# EAGLE design ServoBoard (EAGLE 9.7.0)

## Sheet 1 of 4
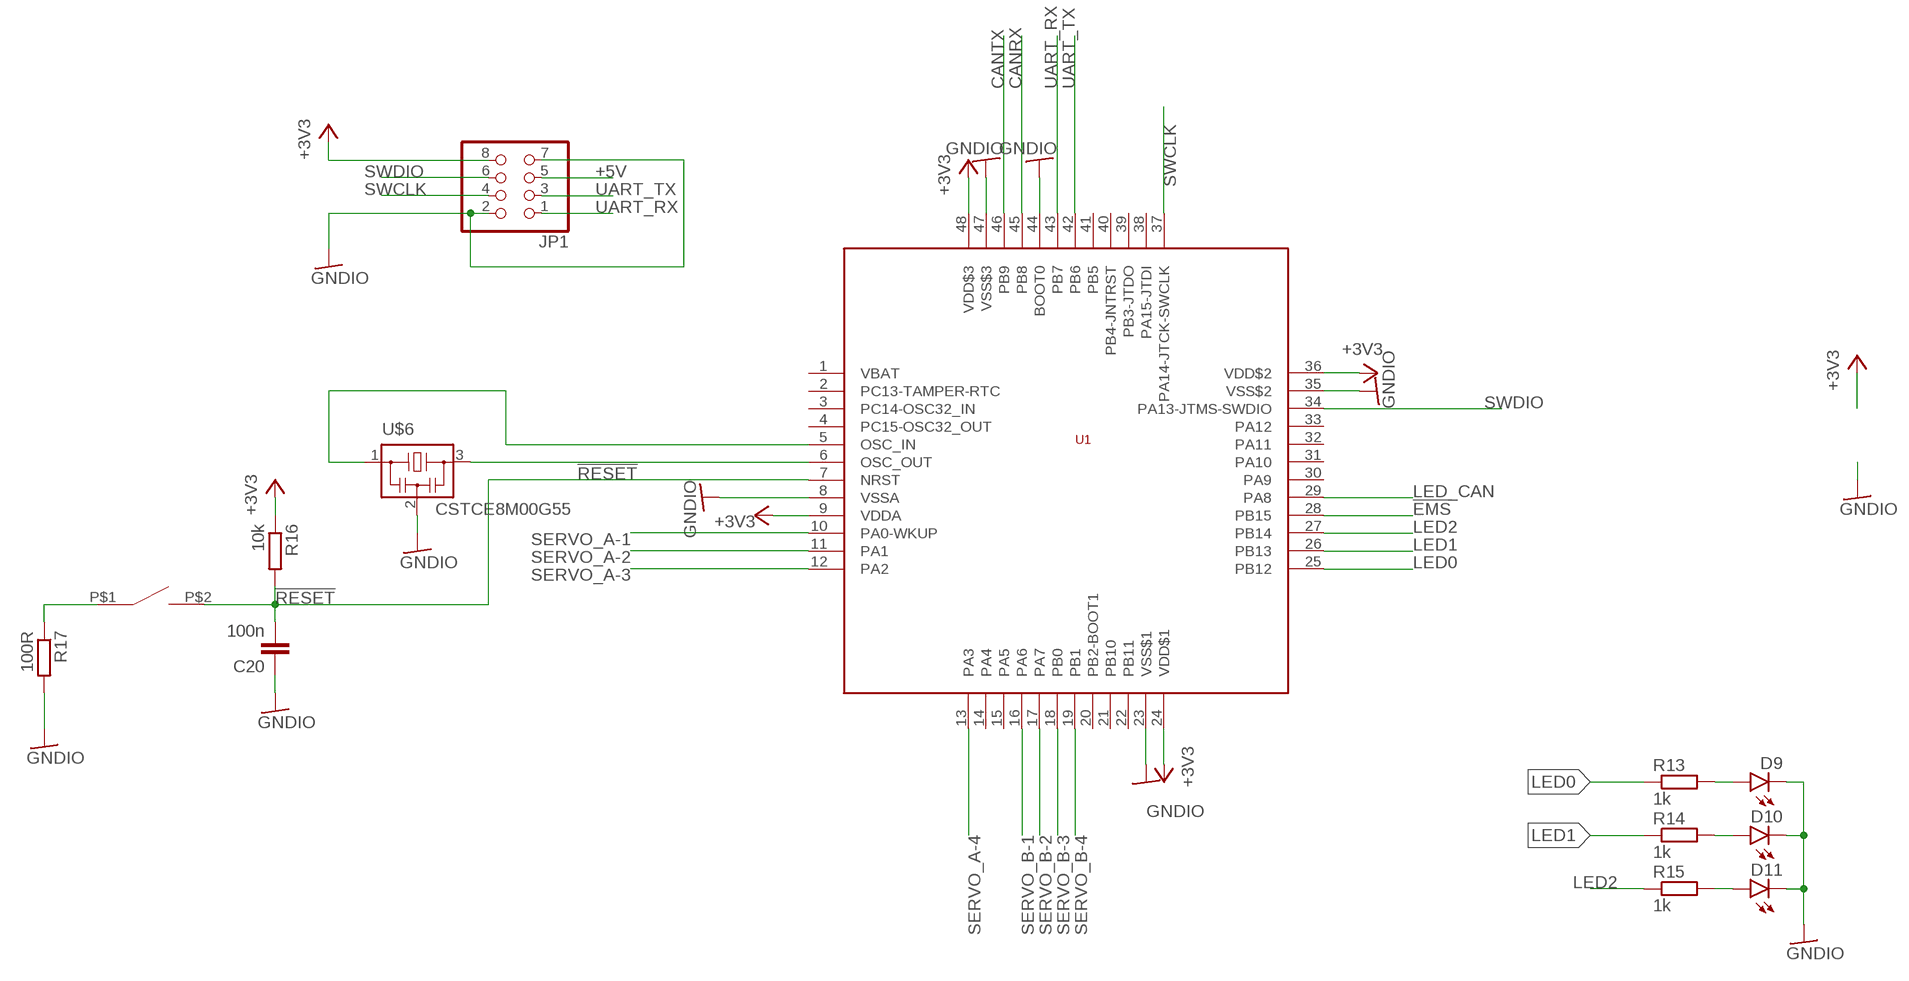
[diagram p0: schematic, sheet 1]

### Parts
C20  100n  C-EUC0603  [C0603]
D9  LEDCHIPLED_0805  [CHIPLED_0805]
D10  LEDCHIPLED_0805  [CHIPLED_0805]
D11  LEDCHIPLED_0805  [CHIPLED_0805]
JP1  PINHD-2X4  [2X04]
R13  1k  R-EU_R0603  [R0603]
R14  1k  R-EU_R0603  [R0603]
R15  1k  R-EU_R0603  [R0603]
R16  10k  R-EU_R0603  [R0603]
R17  100R  R-EU_R0603  [R0603]
SW1  SWITCH_TACTILETOP  [SWITCH_TACTILE_3X6]
U1  STM32F103C8  [LQFP48]
U$6  CSTCE8M00G55  [CSTCE8M00G55]

### Nets
!EMS: U1.28(PB15) ; also sheet 3
!RESET: C20.2 R16.2 SW1.P$2 U1.7(NRST)
+3V3: JP1.8 R16.1 U1.9(VDDA) U1.24(VDD$1) U1.36(VDD$2) U1.48(VDD$3) ; also sheet 2
+5V: JP1.5 ; also sheet 2,3
CANRX: U1.45(PB8) ; also sheet 3
CANTX: U1.46(PB9) ; also sheet 3
GNDIO: C20.1 D9.C D10.C D11.C JP1.2 JP1.7 R17.2 U1.8(VSSA) U1.23(VSS$1) U1.35(VSS$2) U1.44(BOOT0) U1.47(VSS$3) U$6.2 ; also sheet 2,3,4
LED0: R13.1 U1.25(PB12)
LED1: R14.1 U1.26(PB13)
LED2: R15.1 U1.27(PB14)
LED_CAN: U1.29(PA8) ; also sheet 3
N$9: D10.A R14.2
N$10: D9.A R13.2
N$11: U1.6(OSC_OUT) U$6.3
N$16: R17.1 SW1.P$1
N$19: U1.5(OSC_IN) U$6.1
N$21: D11.A R15.2
SERVO_A-1: U1.10(PA0-WKUP) ; also sheet 4
SERVO_A-2: U1.11(PA1) ; also sheet 4
SERVO_A-3: U1.12(PA2) ; also sheet 4
SERVO_A-4: U1.13(PA3) ; also sheet 4
SERVO_B-1: U1.16(PA6) ; also sheet 4
SERVO_B-2: U1.17(PA7) ; also sheet 4
SERVO_B-3: U1.18(PB0) ; also sheet 4
SERVO_B-4: U1.19(PB1) ; also sheet 4
SWCLK: JP1.4 U1.37(PA14-JTCK-SWCLK)
SWDIO: JP1.6 U1.34(PA13-JTMS-SWDIO)
UART_RX: JP1.1 U1.43(PB7)
UART_TX: JP1.3 U1.42(PB6)
Unconnected: U1.1(VBAT) U1.2(PC13-TAMPER-RTC) U1.3(PC14-OSC32_IN) U1.4(PC15-OSC32_OUT) U1.14(PA4) U1.15(PA5) U1.20(PB2-BOOT1) U1.21(PB10) U1.22(PB11) U1.30(PA9) U1.31(PA10) U1.32(PA11) U1.33(PA12) U1.38(PA15-JTDI) U1.39(PB3-JTDO) U1.40(PB4-JNTRST) U1.41(PB5)

## Sheet 2 of 4
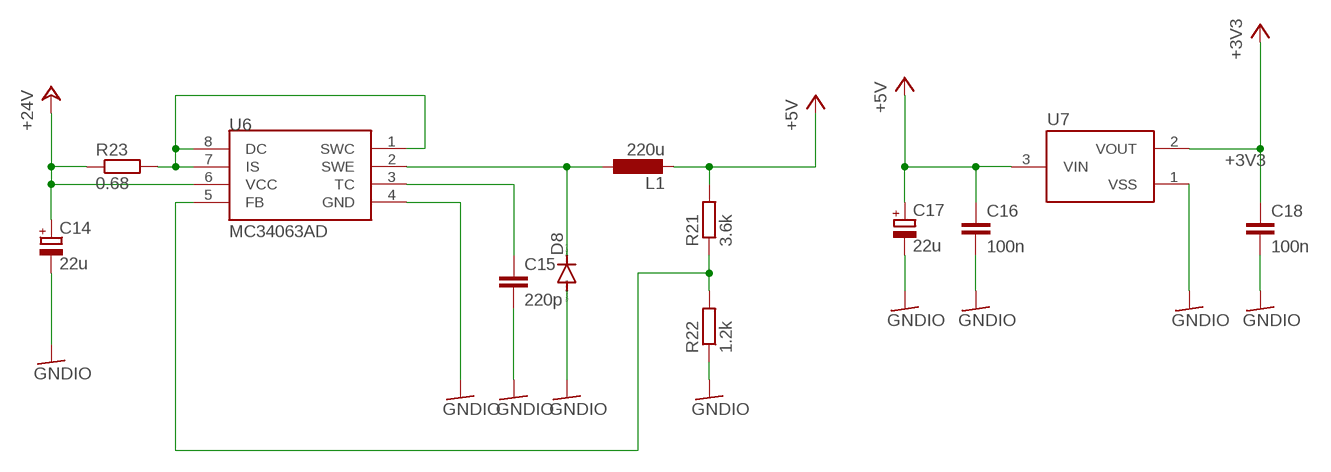
[diagram p1: schematic, sheet 2]

### Parts
C14  22u  CPOL-EUE2-5  [E2-5]
C15  220p  C-EUC0603  [C0603]
C16  100n  C-EUC0603  [C0603]
C17  22u  CPOL-EUE2-5  [E2-5]
C18  100n  C-EUC0603  [C0603]
D8  DIODE-SOD123  [SOD123]
L1  220u  L5852  [L5852]
R21  3.6k  R-EU_R0603  [R0603]
R22  1.2k  R-EU_R0603  [R0603]
R23  0.68  R-EU_R1206  [R1206]
U6  MC34063AD  [SOIC8]
U7  XC6206  [SOT95P240X110-3]

### Nets
+3V3: C18.1 U7.2(VOUT) ; also sheet 1
+5V: C16.1 C17.+ L1.P$2 R21.2 U7.3(VIN) ; also sheet 1,3
+24V: C14.+ R23.1 U6.6(VCC) ; also sheet 3
GNDIO: C14.- C15.2 C16.2 C17.- C18.2 D8.A R22.1 U6.4(GND) U7.1(VSS) ; also sheet 1,3,4
N$13: R23.2 U6.1(SWC) U6.7(IS) U6.8(DC)
N$14: D8.C L1.P$1 U6.2(SWE)
N$15: C15.1 U6.3(TC)
N$17: R21.1 R22.2 U6.5(FB)

## Sheet 3 of 4
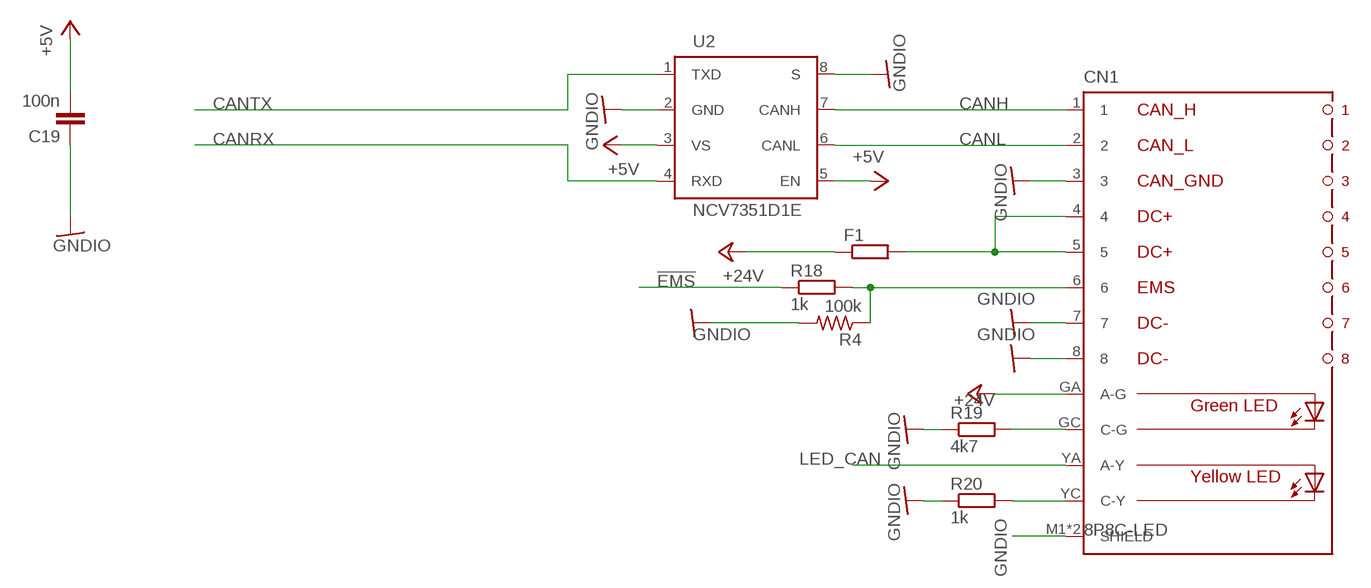
[diagram p2: schematic, sheet 3]

### Parts
C19  100n  C-EUC0603  [C0603]
CN1  8P8C-LED  [8P8C-LED]
F1  R-EU_R1206  [R1206]
R4  100k  R-US_R0603  [R0603]
R18  1k  R-EU_R0603  [R0603]
R19  4k7  R-EU_R0603  [R0603]
R20  1k  R-EU_R0603  [R0603]
U2  NCV7351D1E  [SO08]

### Nets
!EMS: R18.1 ; also sheet 1
+5V: C19.2 U2.3(VS) U2.5(EN) ; also sheet 1,2
+24V: CN1.GA(A-G) F1.1 ; also sheet 2
CANH: CN1.1 U2.7(CANH)
CANL: CN1.2 U2.6(CANL)
CANRX: U2.4(RXD) ; also sheet 1
CANTX: U2.1(TXD) ; also sheet 1
GNDIO: C19.1 CN1.3 CN1.7 CN1.8 CN1.M1(SHIELD) CN1.M2(SHIELD) R4.2 R19.1 R20.1 U2.2(GND) U2.8(S) ; also sheet 1,2,4
LED_CAN: CN1.YA(A-Y) ; also sheet 1
N$12: CN1.4 CN1.5 F1.2
N$18: CN1.YC(C-Y) R20.2
N$22: CN1.GC(C-G) R19.2
N$38: CN1.6 R4.1 R18.2

## Sheet 4 of 4
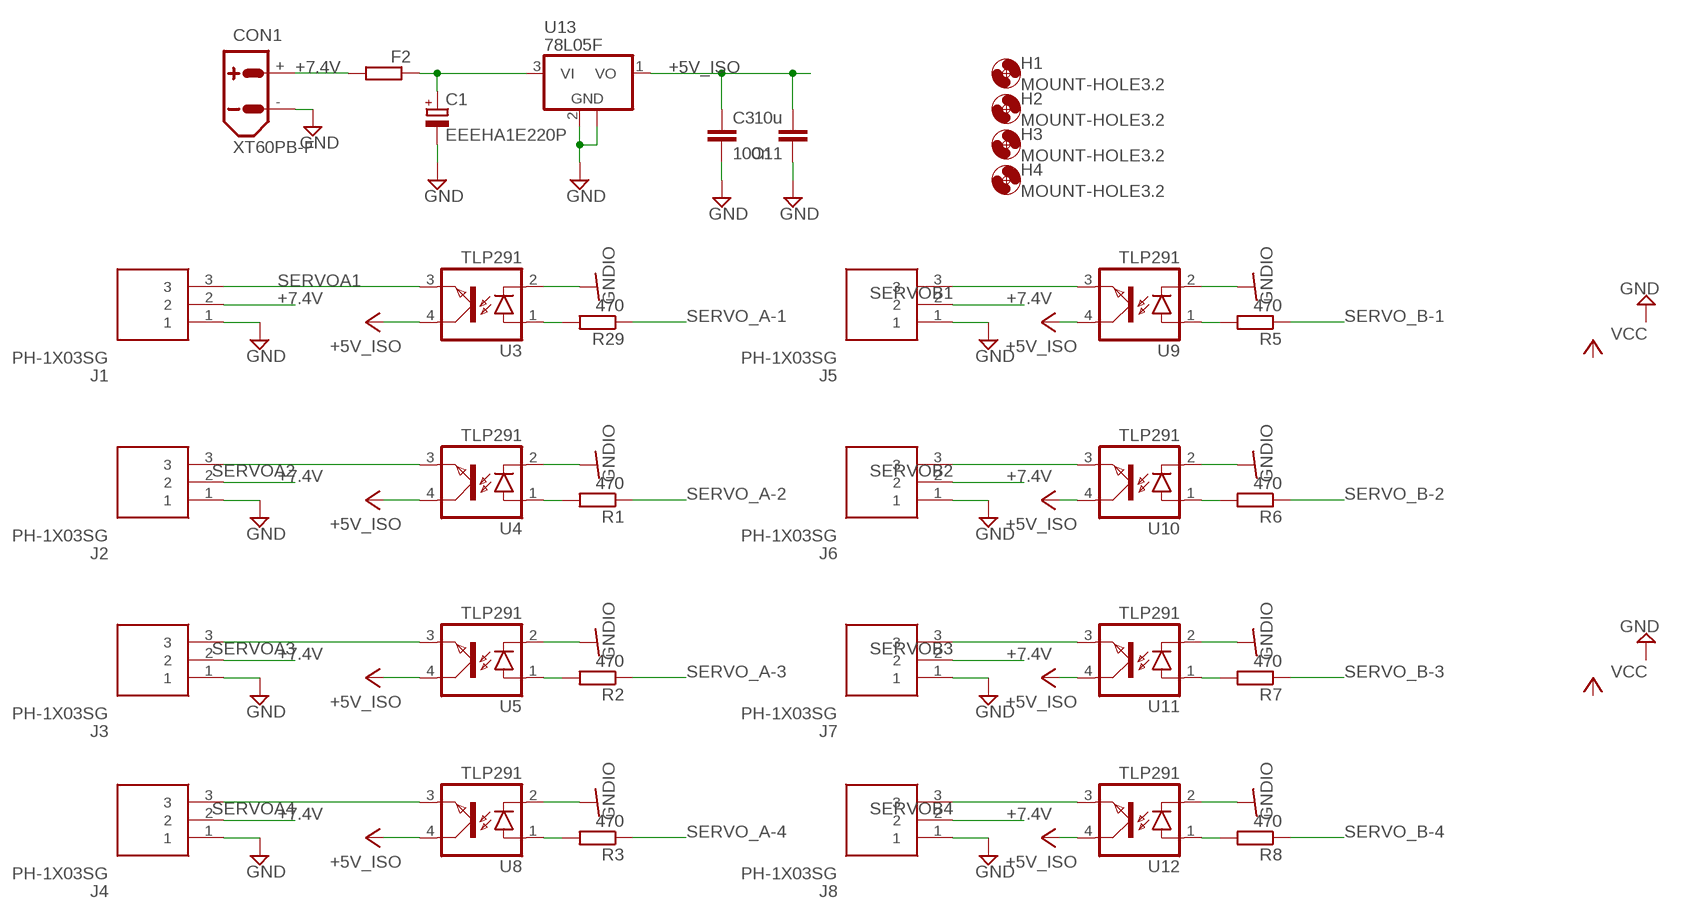
[diagram p3: schematic, sheet 4]

### Parts
C1  EEEHA1E220P  CPOL-EU153CLV-0605  [153CLV-0605]
C3  100n  C-EUC0603  [C0603]
C11  10u  C-EUC1210  [C1210]
CON1  XT60PB-F  [XT60PB-F]
F2  R-EU_R1206  [R1206]
H1  MOUNT-HOLE3.2  [3,2]
H2  MOUNT-HOLE3.2  [3,2]
H3  MOUNT-HOLE3.2  [3,2]
H4  MOUNT-HOLE3.2  [3,2]
J1  PH-1X03SG  [HDRV3W66P254_1X3_762X250X895P]
J2  PH-1X03SG  [HDRV3W66P254_1X3_762X250X895P]
J3  PH-1X03SG  [HDRV3W66P254_1X3_762X250X895P]
J4  PH-1X03SG  [HDRV3W66P254_1X3_762X250X895P]
J5  PH-1X03SG  [HDRV3W66P254_1X3_762X250X895P]
J6  PH-1X03SG  [HDRV3W66P254_1X3_762X250X895P]
J7  PH-1X03SG  [HDRV3W66P254_1X3_762X250X895P]
J8  PH-1X03SG  [HDRV3W66P254_1X3_762X250X895P]
R1  470  R-EU_R0603  [R0603]
R2  470  R-EU_R0603  [R0603]
R3  470  R-EU_R0603  [R0603]
R5  470  R-EU_R0603  [R0603]
R6  470  R-EU_R0603  [R0603]
R7  470  R-EU_R0603  [R0603]
R8  470  R-EU_R0603  [R0603]
R29  470  R-EU_R0603  [R0603]
U3  TLP291  [MINI-FLAT-4]
U4  TLP291  [MINI-FLAT-4]
U5  TLP291  [MINI-FLAT-4]
U8  TLP291  [MINI-FLAT-4]
U9  TLP291  [MINI-FLAT-4]
U10  TLP291  [MINI-FLAT-4]
U11  TLP291  [MINI-FLAT-4]
U12  TLP291  [MINI-FLAT-4]
U13  78L05F  [SOT89]

### Nets
+5V_ISO [wide]: C3.1 C11.2 U3.4(COL) U4.4(COL) U5.4(COL) U8.4(COL) U9.4(COL) U10.4(COL) U11.4(COL) U12.4(COL) U13.1(VO)
+7.4V: CON1.+ F2.2 J1.2 J2.2 J3.2 J4.2 J5.2 J6.2 J7.2 J8.2
GND: C1.- C3.2 C11.1 CON1.- J1.1 J2.1 J3.1 J4.1 J5.1 J6.1 J7.1 J8.1 U13.2(GND) U13.2@1(GND)
GNDIO: U3.2(C) U4.2(C) U5.2(C) U8.2(C) U9.2(C) U10.2(C) U11.2(C) U12.2(C) ; also sheet 1,2,3
N$1: R3.2 U8.1(A)
N$2: R5.2 U9.1(A)
N$3: R1.2 U4.1(A)
N$4 [6A]: C1.+ F2.1 U13.3(VI)
N$5: R6.2 U10.1(A)
N$6: R2.2 U5.1(A)
N$8: R7.2 U11.1(A)
N$20: R29.2 U3.1(A)
N$23: R8.2 U12.1(A)
SERVO_A-1: R29.1 ; also sheet 1
SERVO_A-2: R1.1 ; also sheet 1
SERVO_A-3: R2.1 ; also sheet 1
SERVO_A-4: R3.1 ; also sheet 1
SERVO_B-1: R5.1 ; also sheet 1
SERVO_B-2: R6.1 ; also sheet 1
SERVO_B-3: R7.1 ; also sheet 1
SERVO_B-4: R8.1 ; also sheet 1
SERVOA1: J1.3 U3.3(EMIT)
SERVOA2: J2.3 U4.3(EMIT)
SERVOA3: J3.3 U5.3(EMIT)
SERVOA4: J4.3 U8.3(EMIT)
SERVOB1: J5.3 U9.3(EMIT)
SERVOB2: J6.3 U10.3(EMIT)
SERVOB3: J7.3 U11.3(EMIT)
SERVOB4: J8.3 U12.3(EMIT)

## Library data of the parts
C1 = rcl:CPOL-EU: POLARIZED CAPACITOR, European symbol; SPICEPREFIX: C
C3 C11 C15 = rcl:C-EU: CAPACITOR, European symbol; SPICEPREFIX: C
C14 C17 = rcl:CPOL-EU: POLARIZED CAPACITOR, European symbol
C16 C18-C20 = rcl:C-EU: CAPACITOR, European symbol
CN1 = con-rj45:8P8C-LED: generic 8P8C connector with two LED's; OC_FARNELL: unknown; OC_NEWARK: unknown
CON1 = amass:XT60: AMASS XT60 connector Store in Japan AMASS XT60 connector <https://szc.jp/ams-xt60>
D8 = diode:DIODE-: DIODE
D9-D11 = led:LED: LED OSRAM: - CHIPLED LG R971, LG N971, LY N971, LG Q971, LY Q971, LO R971, LY R971 LH N974, LH R974 LS Q976, LO Q976, LY Q976 LO Q996 - Hyper CHIPLED LW Q18S LB Q993, LB Q99A, LB R99A - SideLED LS A670, LO A670, LY A670, LG A670, LP A670 LB A673, LV A673, LT A673, LW A673 LH A674 LY A675 LS A676, LA A676, LO A676, LY A676, LW A676 LS A679, LY A679, LG A679 - Hyper Micro SIDELED® LS Y876, LA Y876, LO Y876, LY Y876 LT Y87S - SmartLED LW L88C, LW L88S LB L89C, LB L89S, LG L890 LS L89K, LO L89K, LY L89K LS L896, LA L896, LO L896, LY L896 - TOPLED LS T670, LO T670, LY T670, LG T670, LP T670 LSG T670, LSP T670, LSY T670, LOP T670, LYG T670 LG T671, LOG T671, LSG T671 LB T673, LV T673, LT T673, LW T673 LH T674 LS T676, LA T676, LO T676, LY T676, LB T676, LH T676, LSB T676, LW T676 LB T67C, LV T67C, LT T67C, LS T67K, LO T67K, LY T67K, LW E67C LS E67B, LA E67B, LO E67B, LY E67B, LB E67C, LV E67C, LT E67C LW T67C LS T679, LY T679, LG T679 LS T770, LO T770, LY T770, LG T770, LP T770 LB T773, LV T773, LT T773, LW T773 LH T774 LS E675, LA E675, LY E675, LS T675 LS T776, LA T776, LO T776, LY T776, LB T776 LHGB T686 LT T68C, LB T68C - Hyper Mini TOPLED® LB M676 - Mini TOPLED Santana® LG M470 LS M47K, LO M47K, LY M47K Source: http://www.osram.convergy.de LUXEON: - LUMILED® LXK2-PW12-R00, LXK2-PW12-S00, LXK2-PW14-U00, LXK2-PW14-V00 LXK2-PM12-R00, LXK2-PM12-S00, LXK2-PM14-U00 LXK2-PE12-Q00, LXK2-PE12-R00, LXK2-PE12-S00, LXK2-PE14-T00, LXK2-PE14-U00 LXK2-PB12-K00, LXK2-PB12-L00, LXK2-PB12-M00, LXK2-PB14-N00, LXK2-PB14-P00, LXK2-PB14-Q00 LXK2-PR12-L00, LXK2-PR12-M00, LXK2-PR14-Q00, LXK2-PR14-R00 LXK2-PD12-Q00, LXK2-PD12-R00, LXK2-PD12-S00 LXK2-PH12-R00, LXK2-PH12-S00 LXK2-PL12-P00, LXK2-PL12-Q00, LXK2-PL12-R00 Source: www.luxeon.com KINGBRIGHT: KA-3528ASYC Source: www.kingbright.com
F1 F2 R1-R3 R5-R8 R18-R23 R29 = rcl:R-EU_: RESISTOR, European symbol; SPICEPREFIX: R
H1-H4 = holes:MOUNT-HOLE: MOUNTING HOLE with drill center marker
J1-J8 = PH-1X03SG:PH-1X03SG: d Source: Datasheet <http://akizukidenshi.com/download/ds/useconn/PH-1xXXSG-AD.pdf>; DESCRIPTION: d; HEIGHT: 8.95mm; MANUFACTURER_NAME: Useconn Electronics; MANUFACTURER_PART_NUMBER: PH-1X03SG
JP1 = pinhead:PINHD-2X4: PIN HEADER
L1 = l_ysk:L5852
R4 = rcl:R-US_: RESISTOR, American symbol; SPICEPREFIX: R
R13-R17 = rcl:R-EU_: RESISTOR, European symbol
SW1 = switch-tactile:SWITCH_TACTILE
U1 = stm32_mcu:STM32F103C8: STMicroelectronics STM32F103C8 Mainstream Performance line, ARM Cortex-M3 MCU with 64 Kbytes Flash, 72 MHz CPU, motor control, USB and CAN references: datasheet <https://www.st.com/resource/en/datasheet/stm32f103c8.pdf> product page <https://www.st.com/ja/microcontrollers/stm32f103c8.html>
U2 = on-semi:NCV7351D1E: High Speed CAN Transceiver Source: NCV7351-D.PDF <http://www.onsemi.com/PowerSolutions/document/NCV7351-D.PDF>
U3-U5 U8-U12 = toshiba:TLP291: TOSHIBA PHOTOCOUPLER GaAs IRED & PHOTO-TRANSISTOR; OC_FARNELL: unknown; OC_NEWARK: unknown
U6 = mc34063:MC34063
U7 = torex:XC6206
U13 = linear:78L*: POSITOIV-VOLTAGE REGULATORS Output up to 100 mA Source: Datasheet <http://focus.ti.com/lit/ds/symlink/ua78l05.pdf>
U$6 = resonator:CSTCE8M00G55

## Net classes
1 wide: width 0.5 mm
2 6A: width 1 mm

## Board
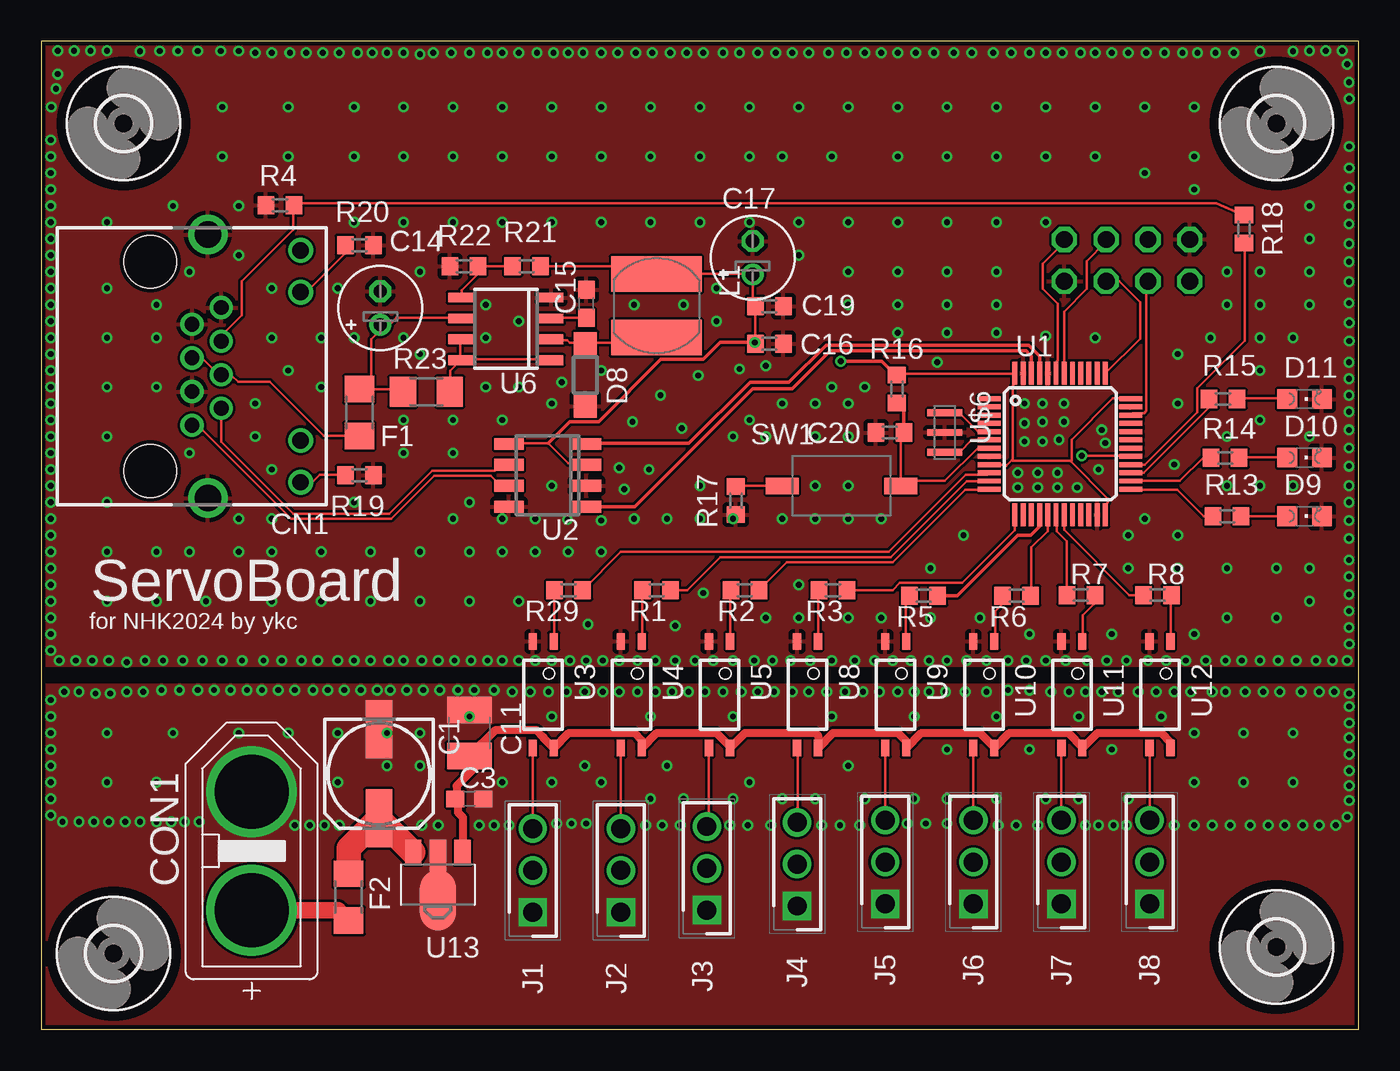
[diagram p4: board, top side]
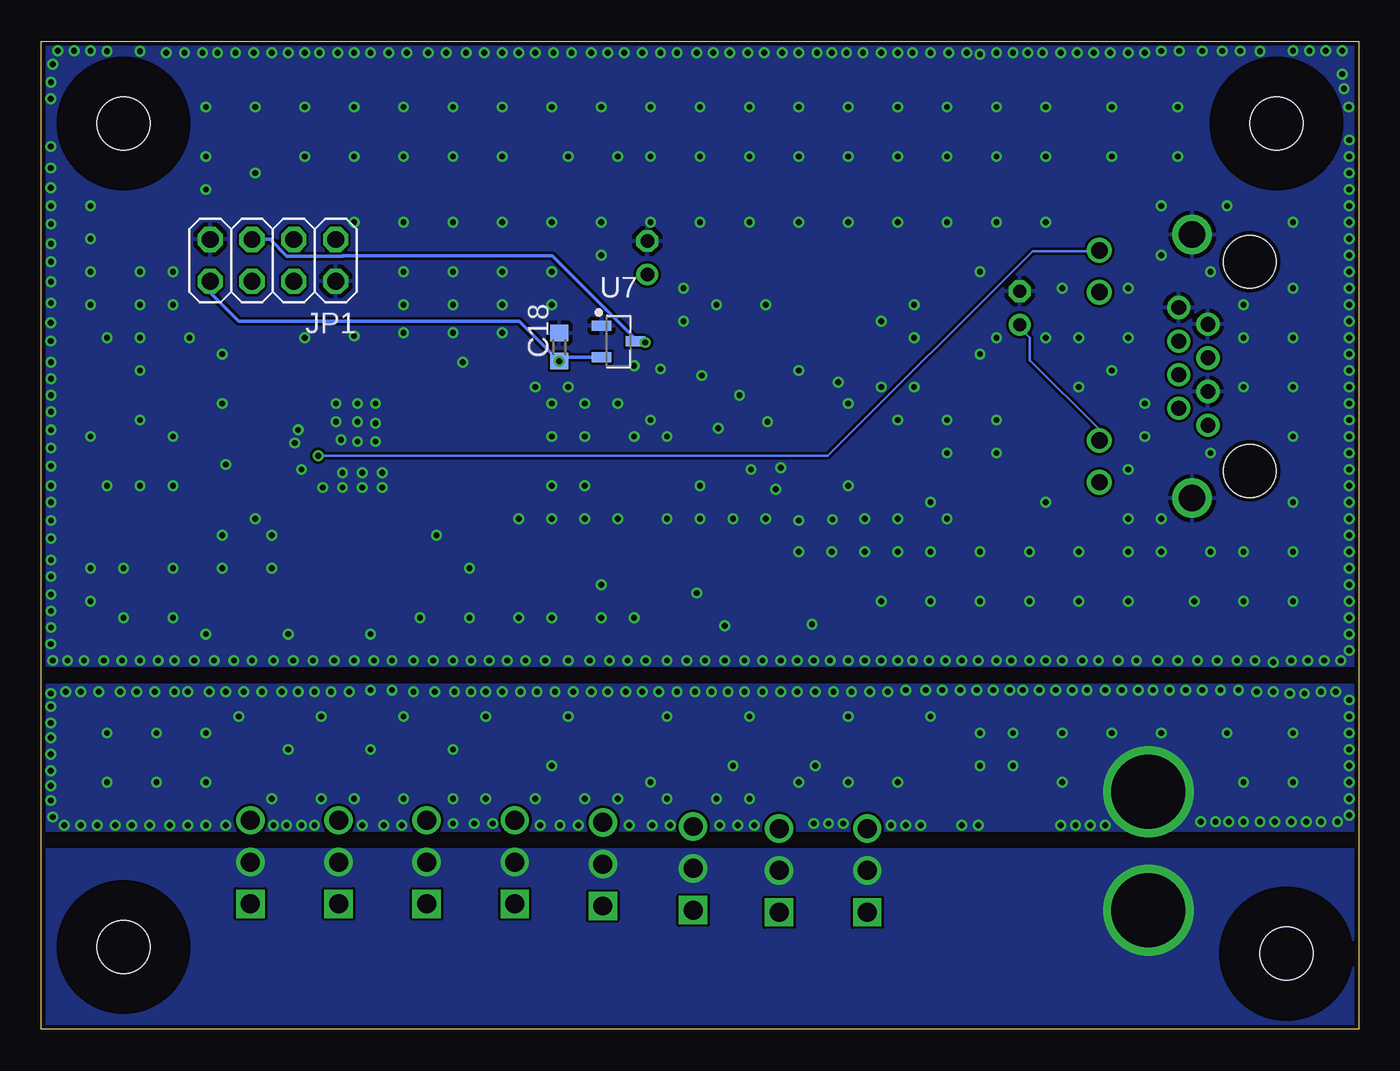
[diagram p5: board, bottom side, seen from below]

Size 80 x 60 mm. Coordinates in mm from the lower left corner, seen from the top.
Outline: 0,0 80,0 80,60 0,60 0,0
Copper layers (1*16): Top 0.035mm / dielectric 1.5mm / Bottom 0.035mm
Design rules "SeeedStudio_2layer_DRU_no_angle_20140221": minimum track width 6mil, minimum drill 12mil, track to track 6mil, track to pad 6mil, pad to pad 6mil, via to via 6mil, smd to smd 0mil, copper to edge 10mil, drill to drill 10mil, minimum pad ring 10mil, minimum via ring 6mil, stop-mask expansion 2mil, vias tented up to drill 100mil, thermal gap 10mil

### Footprints (pad centres in the part's own frame; a part is rotated, then mirrored left to right if it is on the bottom)
153CLV-0605 = smd 3.5 x 1.6: + 2.7,0; - -2.7,0
C0603 = smd 1.1 x 1: 1 -0.85,0; 2 0.85,0
C1210 = smd 1.6 x 2.7: 1 -1.4,0; 2 1.4,0
E2-5 = drill 0.813 pad 1.27: + -1.016,0 | drill 0.813 pad 1.27 octagon: - 1.016,0
C0603' = smd 1 x 1.1: 1 -0.85,0; 2 0.85,0
8P8C-LED = drill 0.9 pad 1.3: 1 3.57,-3.81; 2 2.55,-2.03; 3 1.53,-3.81; 4 0.51,-2.03; 5 -0.51,-3.81; 6 -1.53,-2.03; 7 -2.55,-3.81; 8 -3.57,-2.03 | drill 1 pad 1.422: GA 4.5,2.78; GC 7.04,2.78; YA -7.04,2.78; YC -4.5,2.78 | drill 1.6 pad 2.184: M1 -8,-2.85; M2 8,-2.85 | hole 3.2: 6.35,-6.35; -6.35,-6.35
XT60PB-F = drill 4.5: + 3.6,0; - -3.6,0
SOD123 = smd 1.4 x 1.4: A 1.9,0; C -1.9,0
CHIPLED_0805 = smd 1.2 x 1.2: A 0,-1.05; C 0,1.05
R1206 = smd 1.6 x 1.803: 1 -1.422,0; 2 1.422,0
3,2 = hole 3.2: 0,0
HDRV3W66P254_1X3_762X250X895P = drill 1.15 pad 1.725 square: 1 0,0 | drill 1.15 pad 1.725: 2 2.54,0; 3 5.08,0
2X04 = drill 1.016 octagon: 1 -3.81,-1.27; 2 -3.81,1.27; 3 -1.27,-1.27; 4 -1.27,1.27; 5 1.27,-1.27; 6 1.27,1.27; 7 3.81,-1.27; 8 3.81,1.27
L5852 = smd 2.15 x 5.5: P$1 1.925,0; P$2 -1.925,0
R0603 = smd 1 x 1.1: 1 -0.85,0; 2 0.85,0
SWITCH_TACTILE_3X6 = smd 2 x 1: P$1 -3.6,0; P$2 3.6,0
LQFP48 = smd 1.4 x 0.3: 1 -4.3,2.75; 2 -4.3,2.25; 3 -4.3,1.75; 4 -4.3,1.25; 5 -4.3,0.75; 6 -4.3,0.25; 7 -4.3,-0.25; 8 -4.3,-0.75; 9 -4.3,-1.25; 10 -4.3,-1.75; 11 -4.3,-2.25; 12 -4.3,-2.75; 25 4.3,-2.75; 26 4.3,-2.25; 27 4.3,-1.75; 28 4.3,-1.25; 29 4.3,-0.75; 30 4.3,-0.25; 31 4.3,0.25; 32 4.3,0.75; 33 4.3,1.25; 34 4.3,1.75; 35 4.3,2.25; 36 4.3,2.75 | smd 0.3 x 1.4: 13 -2.75,-4.3; 14 -2.25,-4.3; 15 -1.75,-4.3; 16 -1.25,-4.3; 17 -0.75,-4.3; 18 -0.25,-4.3; 19 0.25,-4.3; 20 0.75,-4.3; 21 1.25,-4.3; 22 1.75,-4.3; 23 2.25,-4.3; 24 2.75,-4.3; 37 2.75,4.3; 38 2.25,4.3; 39 1.75,4.3; 40 1.25,4.3; 41 0.75,4.3; 42 0.25,4.3; 43 -0.25,4.3; 44 -0.75,4.3; 45 -1.25,4.3; 46 -1.75,4.3; 47 -2.25,4.3; 48 -2.75,4.3
SO08 = smd 0.72 x 1.78: 1 -1.905,-2.35; 2 -0.635,-2.35; 3 0.635,-2.35; 4 1.905,-2.35; 5 1.905,2.35; 6 0.635,2.35; 7 -0.635,2.35; 8 -1.905,2.35
MINI-FLAT-4 = smd 1 x 0.5: 1 -3.24,0.635; 2 -3.24,-0.635; 3 3.24,-0.635; 4 3.24,0.635
SOIC8 = smd 0.6 x 1.5: 1 -1.905,-2.75; 2 -0.635,-2.75; 3 0.635,-2.75; 4 1.905,-2.75; 5 1.905,2.75; 6 0.635,2.75; 7 -0.635,2.75; 8 -1.905,2.75
SOT95P240X110-3 = smd 1.18 x 0.609: 1 -1.024,0.95; 2 -1.024,-0.95; 3 1.024,0
SOT89 = smd 1 x 1.5: 1 -1.499,-1.981; 3 1.499,-1.981 | smd 1 x 2: 2 0,-1.727 | smd 2.2 x 3.7: 2@1 0,0.94
CSTCE8M00G55 = smd 0.4 x 2.1: 1 -1.2,0; 2 0,0; 3 1.2,0

### Placement (x,y rotation side)
C1  20.51,15.52 270 top
C3  26,14 0 top
C11  26,18 270 top
C14  20.59,43.8 90 top
C15  33.11,44.05 90 top
C16  100n  [C0603']  44.21,41.62 0 top
C17  43.2,46.85 90 top
C18  100n  [C0603']  48.55,41.42 90 bottom
C19  100n  [C0603']  44.21,43.91 180 top
C20  100n  [C0603']  51.52,36.24 0 top
CN1  12.97,40.26 270 top
CON1  12.77,10.84 270 top
D8  33.04,39.74 270 top
D9  76.71,31.16 270 top
D10  76.71,34.72 270 top
D11  76.71,38.27 270 top
F1  19.32,37.45 270 top
F2  18.66,8.03 270 top
H1  5,55 0 top
H2  75,55 0 top
H3  4.4,4.6 0 top
H4  75,5 0 top
J1  29.84,7.11 90 top
J2  35.2,7.11 90 top
J3  40.42,7.24 90 top
J4  45.9,7.49 90 top
J5  51.24,7.62 90 top
J6  56.59,7.62 90 top
J7  61.95,7.62 90 top
J8  67.3,7.62 90 top
JP1  65.93,46.69 180 bottom
L1  37.35,43.93 270 top
R1  37.37,26.67 180 top
R2  42.72,26.67 180 top
R3  48.07,26.67 180 top
R4  14.49,50.04 180 top
R5  53.58,26.33 180 top
R6  59.23,26.33 180 top
R7  63.12,26.37 0 top
R8  67.77,26.37 0 top
R13  72.01,31.16 0 top
R14  71.88,34.7 0 top
R15  71.75,38.27 0 top
R16  51.96,38.88 270 top
R17  42.18,32.1 270 top
R18  73.03,48.59 90 top
R19  19.32,33.64 180 top
R20  19.32,47.61 180 top
R21  29.48,46.34 0 top
R22  25.67,46.34 0 top
R23  23.38,38.72 0 top
R29  32.02,26.67 180 top
SW1  48.59,33.01 0 top
U1  61.87,35.55 0 top
U2  30.75,33.64 90 top
U3  30.48,20.32 270 top
U4  35.83,20.32 270 top
U5  41.18,20.32 270 top
U6  28.21,42.53 90 top
U7  44.95,41.77 0 bottom
U8  46.53,20.32 270 top
U9  51.88,20.32 270 top
U10  57.23,20.32 270 top
U11  62.58,20.32 270 top
U12  67.93,20.32 270 top
U13  24.09,8.78 180 top
U$6  54.86,36.24 270 top

### Tracks (layer width: path | path; a pad name or v marks a point on that pad's centre or on a via)
!EMS
  Top 0.152: R18.1 73.08,47.7 73.08,41.82 70.18,38.92 70.18,37.47 67,34.29 66.22,34.29 U1.28
!RESET
  Top 0.152: U1.7 57.53,35.36 56.92,35.36 54.86,33.3 52.43,33.3 52.2,33.07 SW1.P$2 52.2,36.06 C20.2
  Top 0.2: R16.2 52.37,37.62 C20.2
+3V3  (via drill 0.35)
  Top 0.152: 58.94,34.56 58.98,34.59 58.98,39.09 59.05,39.17 59.05,39.47 | 58.94,34.56 58.6,34.21 58.52,34.29 57.61,34.29 U1.9 | 59.05,39.47 59.05,39.78 U1.48 59.11,39.82 | 62.52,34.48 62.48,34.52 58.98,34.52 58.94,34.56 | 62.52,34.48 64.77,32.23 64.77,32 64.62,31.85 64.62,31.32 U1.24 | 62.52,34.48 62.56,34.52 62.56,35.81 65.08,38.33 66.13,38.33 U1.36 | 59.11,39.82 59.05,39.47 | R16.1 51.96,39.74 52.04,39.82 59.11,39.82
  Top 0.2: C18.1 51.05,40.57 51.87,39.74 51.96,39.74
  Bottom 0.2: U7.2 48.29,40.82 C18.1 50.98,43 68,43 69.74,44.74 JP1.8
  other vias: 48.55,40.57
+5V  (via drill 0.35)
  Top 0.152: R21.2 30.4,46.33 36.88,46.33 37.34,45.87 L1.P$2 37.41,45.87 43.13,45.87 43.17,45.83 C17.+ 43.2,43.83 43.28,43.83 C19.2 43.36,41.69 C16.1 | U2.5 28.42,35.59 30.79,35.59 32,34.37 32.99,34.37 33.07,34.29 U2.3
  Top 0.2: 30.79,35.59 32.08,36.88 33.84,36.88 37.63,40.67 40.21,40.67 41.24,41.71 v43.32,41.71 43.36,41.67 C16.1
  Bottom 0.2: v43.32,41.71 43.86,41.71 U7.3 43.92,41.92 48.96,46.96 61.68,46.96 61.7,46.95 65.08,46.95 66.09,47.96 JP1.5
+5V_ISO
  Top 0.5: U13.1 25.6,10.82 25.6,12.88 25.3,13.18 25.3,13.72 25.38,13.79 25.38,13.87 C3.1 25.22,14.02 25.22,14.78 26.36,15.93 C11.2 27.55,18.15 30.09,18.15 30.5,17.75 30.5,17.7 U3.4 32.03,18 36,18 36.47,17.54 U4.4 37.38,18 41,18 41.81,17.18 U5.4 42.73,18 47,18 47.16,17.84 U8.4 48.09,18 52,18 52.52,17.48 U9.4 53.44,18 57,18 57.87,17.14 U10.4 58.78,18 62.34,18 63.22,17.13 U11.4 64.14,18 68,18 68.56,17.43 U12.4
+7.4V
  Top 1.016: CON1.+ 18.03,7.24 F2.2
  pour Bottom (no thermals): 0.08,0.08 79.92,0.08 79.92,10.92 0.08,10.92
+24V
  Top 0.152: 20.04,38.86 21.87,38.86 21.95,38.79 R23.1 | 20.04,38.86 19.36,38.86 F1.1 20.04,38.86 | U6.6 25.45,43.2 21.57,43.2 21.18,42.82 20.65,42.82 C14.+ 20.57,42.75 20.57,42.44 20.04,41.91 20.04,38.86
  Bottom 0.152: CN1.GA 15.77,35.81 15.77,36.42 19.96,40.62 19.96,41.99 20.57,42.6 20.57,42.75 C14.+
CANH
  Top 0.152: CN1.1 9.22,36.65 9.53,36.65 15.17,31 21.27,31 23.87,33.6 27.3,33.6 27.9,33.01 U2.7
CANL
  Top 0.152: CN1.2 10.94,35.67 15.3,31.31 21.14,31.31 23.74,33.91 27.54,33.91 27.9,34.27 U2.6
CANRX
  Top 0.2: U2.4 33.13,35.57 39.33,35.57 43.05,39.3 45.4,39.3 47.65,41.55 59.95,41.55 60.62,40.88 U1.45
CANTX
  Top 0.2: U2.1 36.03,31.73 43.2,38.9 45.6,38.9 47.9,41.2 59.8,41.2 60,41 60.12,40.88 U1.46
GND  (via drill 0.35)
  other vias: 0.58,20 0.58,19 0.58,18 0.58,17 0.58,16 0.58,15 0.58,14 0.58,13 1.3,12.6 2.3,12.6 3.2,12.6 4.1,12.6 5.1,12.6 6,12.6 7,12.6 7.9,12.6 8.7,12.6 9.6,12.6 15.4,12.4 16.3,12.4 17.2,12.4 23.1,12.4 24.1,12.4 26.6,12.4 27.5,12.4 28.4,12.4 31.3,12.5 32.2,12.5 33.1,12.5 36.7,12.4 37.7,12.4 38.8,12.4 41.8,12.4 42.9,12.4 44.3,12.4 47.4,12.4 48.5,12.4 49.7,12.4 52.59,12.5 53.7,12.5 55,12.5 58.1,12.4 59.2,12.4 60.5,12.4 63.4,12.4 64.2,12.4 65.9,12.4 65.1,12.4 68.8,12.4 70,12.4 71.1,12.4 72.2,12.4 73.4,12.4 74.5,12.4 75.5,12.4 76.6,12.4 77.6,12.4 78.6,12.4 79.3,12.9 79.42,20.4 79.42,19.6 79.42,18.6 79.42,17.7 79.42,16.7 79.42,15.7 79.42,14.8 79.42,13.9 78.5,20.5 77.6,20.5 76.5,20.5 75.2,20.5 74.2,20.5 73.1,20.5 71.9,20.5 71.1,20.5 69.8,20.5 68.8,20.5 67.7,20.5 66.6,20.5 65.4,20.5 64.4,20.5 63.4,20.5 62.4,20.5 61.3,20.5 60,20.6 58.7,20.6 57.4,20.5 56.1,20.5 54.9,20.5 53.9,20.5 53,20.5 52,20.5 50.9,20.5 49.9,20.5 48.8,20.5 47.7,20.5 46.6,20.5 45.6,20.5 44.5,20.5 43.5,20.5 42.5,20.5 41.4,20.5 40.3,20.5 39.3,20.5 38.3,20.5 37.3,20.5 36.2,20.5 35.1,20.5 34.1,20.5 33,20.5 31.9,20.5 30.8,20.5 29.7,20.5 28.6,20.5 27.5,20.6 26.3,20.6 25.3,20.6 24.2,20.6 23.2,20.6 22.2,20.6 21.2,20.6 20.4,20.6 19.4,20.6 18.4,20.6 17.4,20.6 16.5,20.6 15.4,20.6 1.4,20.5 2.3,20.5 3.3,20.4 4.2,20.4 5.2,20.5 6.2,20.5 7.3,20.6 8.4,20.6 9.5,20.6 10.5,20.6 11.5,20.6 12.5,20.6 13.4,20.6 14.4,20.6 18.1,12.4 18,15 18,18 21,18 23,18 23,16 21,16 28,15 31,15 34,15 33,16 37,14 38,16 39,14 42,14 43,15 45,14 47,14 49,16 50,14 53,14 55,17 55,14 58,14 60,17 61,14 63,14 65,17 66,14 70,15 70,18 73,18 73,15 76,15 76,18 7,15 4,15 4,18 8,18 12,18 15,18 26,19 31,19 37,19 42,19 48,19 53,19 58,19 63,19 68,19
  pour Top (no thermals): 0.08,0.08 79.92,0.08 79.92,20.92 0.08,20.92
  pour Bottom (no thermals): 0.08,12.08 79.92,12.08 79.92,20.92 0.08,20.92
GNDIO  (via drill 0.35)
  Top 0.2: 50.72,36.28 C20.1
  other vias: 64.4,36.4 62.1,38 64,42 54.4,40.5 0.58,23 0.58,24 0.58,25 0.58,26 0.58,27 0.58,28 0.58,29 0.58,30 0.58,31 0.58,32 0.58,33 0.58,34 0.58,35 0.58,36 0.58,37 0.58,39 0.58,38 0.58,40 0.58,41 0.58,42 0.58,43 0.58,44 0.58,45 0.58,46 0.58,47 0.58,48 0.58,49 0.58,50 0.58,51 0.58,52 0.58,53 0.58,54 0.61,56 1,59.42 1,58 0.89,57.11 2,59.42 3,59.42 4,59.42 6,59.39 78,59.42 79,59.42 77,59.42 76,59.39 74,59.39 1.1,22.4 2.1,22.4 3.1,22.4 4.1,22.4 5.2,22.3 6.3,22.4 7.4,22.4 8.6,22.4 9.8,22.4 11,22.4 12.2,22.4 13.5,22.4 14.6,22.4 15.8,22.4 16.8,22.4 18,22.4 19,22.4 20,22.4 21.1,22.4 22,22.4 23.1,22.4 24.1,22.4 25.1,22.4 26.1,22.4 27.1,22.4 28,22.4 29,22.4 30,22.4 31,22.4 32.1,22.4 33.1,22.4 34.1,22.4 35.1,22.4 36.2,22.4 37.3,22.4 38.5,22.4 39.7,22.4 40.8,22.4 42,22.4 43.3,22.4 44.4,22.4 45.5,22.4 46.7,22.4 48,22.4 49.4,22.4 50.6,22.4 51.7,22.4 52.8,22.4 53.9,22.4 55,22.4 56.2,22.4 57.4,22.4 58.7,22.4 59.8,22.4 61,22.4 62.2,22.4 63.5,22.4 64.7,22.4 65.9,22.4 67.2,22.4 68.3,22.4 69.5,22.4 70.7,22.4 71.9,22.4 72.9,22.4 74,22.4 75.1,22.4 76.2,22.4 77.4,22.4 78.4,22.4 79.3,22.4 79.42,23.4 79.3,58.6 79.4,57.5 79.42,56.5 79.42,53.6 79.42,52.3 79.42,51.1 7.2,59.4 8.3,59.4 9.5,59.4 10.9,59.4 12,59.4 13,59.3 14,59.3 15.1,59.3 16.1,59.3 17.1,59.3 18.1,59.3 19.2,59.3 20.1,59.3 21,59.3 22,59.3 23,59.2 23.8,59.3 24.9,59.3 26,59.3 27.1,59.3 28,59.3 29,59.3 30.1,59.3 31.1,59.3 32,59.3 32.9,59.3 34,59.3 35,59.3 36.1,59.3 37.1,59.3 38.2,59.3 39.2,59.3 40.2,59.3 41.4,59.3 42.4,59.3 43.5,59.3 44.6,59.3 45.6,59.3 46.6,59.3 47.8,59.3 48.9,59.3 50,59.3 51,59.3 52,59.3 53.1,59.3 54.2,59.3 55.4,59.3 56.5,59.3 57.8,59.3 58.9,59.3 60,59.3 61,59.3 62,59.3 63.1,59.3 64,59.3 65,59.3 66,59.3 67.1,59.3 68.2,59.3 69.3,59.3 70.2,59.3 71.3,59.3 72.4,59.3 79.4,24.4 79.4,25.4 79.4,26.4 79.4,27.5 79.4,28.5 79.4,29.8 79.4,30.9 79.4,32 79.4,33 79.4,34.2 79.4,35.3 79.4,36.4 79.4,37.5 79.4,38.5 79.4,39.5 79.4,40.5 79.42,41.8 79.42,42.9 79.4,44.1 79.4,50 79.4,48.9 79.4,47.7 79.4,46.6 79.4,45.4 11,56 15,56 19,56 22,56 25,56 28,56 31,56 34,56 37,56 40,56 43,56 46,56 49,56 52,56 55,56 58,56 61,56 64,56 67,56 67,52 64,53 61,53 58,53 55,53 52,53 48,53 45,53 43,53 40,53 37,53 34,53 31,53 28,53 25,53 22,53 19,53 15,53 11,53 58,49 55,49 52,49 49,49 46,49 43,49 40,49 37,49 34,49 31,49 28,49 25,49 22,49 19,49 12,50 14,45 14,42 17,39 17,42 18,45 19,42 22,42 23,41 23,46 27,44 29,43 27,42 29,39 27,39 49,46 52,46 55,46 58,46 58,44 55,44 52,44 49,44 52,42.3 55,42.3 58,42.3 61,42.1 59.7,38 60.8,38 59.7,36.8 60.8,36.9 62.1,36.9 59.7,35.7 60.8,35.7 61.8,35.8 64.6,35.6 64.2,34 59.3,32.9 59.3,33.8 60.5,33.8 60.5,32.9 61.7,32.9 61.7,33.8 62.9,32.9 56,30 54,28 46,27 46,25 44,25 49,25 51,25 54,25 57,25 60,24 65,24 70,24 66,28 66,30 69,30 67,31 69,28 72,28 75,28 77,28 77,26 75,25 72,25 72,33 76,33 72,36 77,36 74,37 74,33 74,40 69,38 69,41 71,42 72,44 72,46 74,46 74,44 74,42 76,42 77,44 77,46 77,48 77,50 70,53 70,56 42,36 44,36 47,36 49,36 49,38 47,38 45,38 50,39 48,39 47,33 49,33 49,31 47,31 45,31 51,31 40,31 42,31 38,31 40,33 36,31 34,30.9 34,29 32,29 31.95,30.95 31,33 30,31 30,29 28,29 28,31 25,31 26,29 23,29 20,29 17,29 14,29 14,31 12,31 12,29 9,29 7,29 4,29 4,26 7,26 10,26 14,26 17,26 20,26 23,26 26,26 29,26 4,32 4,36 4,39 7,39 9,35 4,42 4,45 7,42 7,44 9,46 12,47 15,40 13,38 13,36 14,34 19,32 22,35 22,37 25,37 25,35 28,37 31,38 34,40 31.6,39.3 35.9,36.9 37.6,38.5 39.9,39.7 38.9,36.5 42.4,40.1 44,40.3 68.8,34.3 40.2,26.5 38.5,24.5 33.2,24.6 35.1,34.1 36.9,34 35.4,32.8 41,43 41,45 36,44 39,44 46,47 61,49 70,51 4,49 8,50 26,32 43,37
  pour Top: 0.08,22.08 79.92,22.08 79.92,59.92 0.08,59.92
  pour Bottom: 0.08,22.08 79.92,22.08 79.92,59.92 0.08,59.92
LED0
  Top 0.152: R13.1 71.09,31.16 70.59,31.16 68.98,32.77 66.22,32.77 U1.25
LED1
  Top 0.152: R14.1 71.02,34.74 70.57,34.74 69.13,33.3 66.22,33.3 U1.26
LED2
  Top 0.152: R15.1 70.94,38.24 70.94,37.8 66.94,33.8 U1.27
LED_CAN  (via drill 0.35)
  Top 0.152: v63.17,34.82 66.14,34.82 U1.29
  Bottom 0.152: CN1.YA 15.77,47.24 19.81,47.24 32.23,34.82 v63.17,34.82
N$1
  Top 0.152: U8.1 47.17,23.62 47.17,26.67 R3.2
N$2
  Top 0.152: U9.1 52.5,23.62 52.5,26.14 52.65,26.29 R5.2
N$3
  Top 0.152: U4.1 36.5,23.62 36.5,26.67 R1.2
N$4
  Top 1.5: F2.1 18.67,9.53 18.67,10.99 C1.+ 22.57,10.76 U13.3
N$5
  Top 0.152: U10.1 57.91,23.62 57.91,25.38 58.37,25.83 58.37,26.29 R6.2
N$6
  Top 0.152: U5.1 41.83,23.62 41.83,26.67 R2.2
N$8
  Top 0.152: U11.1 63.25,23.62 63.25,25.15 63.93,25.83 63.93,26.36 R7.2
N$9
  Top 0.152: R14.2 72.77,34.74 75.59,34.74 D10.A
N$10
  Top 0.152: R13.2 72.92,31.16 75.59,31.16 D9.A
N$11
  Top 0.152: U1.6 56.51,35.8 55.76,35.04 U$6.3
N$12
  Top 0.152: F1.2 19.28,36.04 17.14,36.04 13.87,39.32 11.96,39.32 11.58,39.7 10.97,39.7 CN1.4 10.9,39.78 10.74,39.78 9.75,40.77 9.22,40.77 CN1.5
N$13
  Top 0.152: U6.8 25.45,40.69 25.45,41.83 U6.7 | U6.1 30.94,40.69 25.53,40.69 U6.8 | R23.2 24.84,38.79 24.84,40.01 U6.8
N$14
  Top 0.152: U6.2 31.01,41.83 31.93,41.83 32.08,41.68 32.99,41.68 D8.C 33.07,41.68 37.03,41.68 37.34,41.99 L1.P$1
N$15
  Top 0.152: C15.1 33.07,43.2 31.01,43.2 U6.3
N$16
  Top 0.152: R17.1 42.23,32.99 44.96,32.99 SW1.P$1
N$17
  Top 0.152: R21.1 28.57,46.33 26.59,46.33 R22.2 26.59,46.25 26.59,45.95 25.53,44.88 25.53,44.5 U6.5
N$18
  Top 0.152: R20.2 18.44,47.55 18.44,47.09 16.15,44.81 15.77,44.81 CN1.YC
N$19
  Top 0.152: U$6.1 55.77,37.44 55.75,37.44 56.87,36.32 57.54,36.32 U1.5
N$20
  Top 0.152: U3.1 31.17,23.62 R29.2
N$21
  Top 0.152: R15.2 72.62,38.32 75.59,38.32 D11.A
N$22
  Top 0.152: R19.2 18.44,33.68 16.92,33.68 16.46,33.22 15.77,33.22 CN1.GC
N$23
  Top 0.152: U12.1 68.58,23.62 68.58,26.36 R8.2
N$38
  Top 0.152: 15.32,49.76 15.32,48.54 12.19,45.41 12.19,43.36 10.97,42.14 10.97,41.83 CN1.6 | R4.1 15.46,50.16 71.34,50.16 R18.2 | 15.32,49.76 15.32,49.99 R4.1 | 15.32,49.76 R4.1
SERVO_A-1
  Top 0.152: R29.1 35.2,29 51.47,29 56.14,33.67 57.44,33.67 U1.10
SERVO_A-2
  Top 0.152: U1.11 56.19,33.3 51.57,28.68 41.23,28.68 39.22,26.67 R1.1
SERVO_A-3
  Top 0.152: U1.12 57.53,32.77 56.09,32.77 51.7,28.37 45.27,28.37 R2.1
SERVO_A-4
  Top 0.152: R3.1 51.7,26.67 52.13,27.11 55.92,27.11 59.12,30.3 U1.13
SERVO_B-1
  Top 0.2: R5.1 55.63,26.33 59.3,30 60.08,30 60.62,30.54 U1.16
SERVO_B-2
  Top 0.152: R6.1 60.12,26.36 60.12,29.26 61.11,30.25 U1.17
SERVO_B-3
  Top 0.152: R7.1 62.26,26.44 62.26,29.64 61.65,30.25 61.65,31.24 U1.18
SERVO_B-4
  Top 0.152: R8.1 66.9,26.36 66.06,26.36 62.1,30.33 62.1,31.24 U1.19
SERVOA1
  Top 0.152: U3.3 J1.3
SERVOA2
  Top 0.152: U4.3 J2.3
SERVOA3
  Top 0.152: U5.3 40.54,17.07 40.54,12.42 40.46,12.34 J3.3
SERVOA4
  Top 0.152: U8.3 45.95,17.07 45.95,13.49 45.87,13.41 45.87,12.57 J4.3
SERVOB1
  Top 0.152: J5.3 U9.3
SERVOB2
  Top 0.152: J6.3 U10.3
SERVOB3
  Top 0.152: J7.3 U11.3
SERVOB4
  Top 0.152: J8.3 U12.3
SWCLK
  Top 0.152: JP1.4 65.46,45.42 66.72,44.16 66.72,41.95 U1.37
SWDIO
  Top 0.152: U1.34 66.29,37.42 66.96,37.42 67.09,37.55 67.09,45.31 JP1.6
UART_RX
  Top 0.152: U1.43 61.65,39.85 61.65,40.54 61.72,40.62 61.72,44.04 60.81,44.96 60.81,46.48 62.1,47.78 62.1,47.93 JP1.1
UART_TX
  Top 0.152: U1.42 62.1,39.85 62.1,43.59 63.48,44.96 63.48,46.63 64.62,47.78 64.62,47.93 JP1.3

### Text on the board
tPlace: ServoBoard | for NHK2024 by ykc